# EAGLE board main (EAGLE 8.7.0)
TEXT: foo
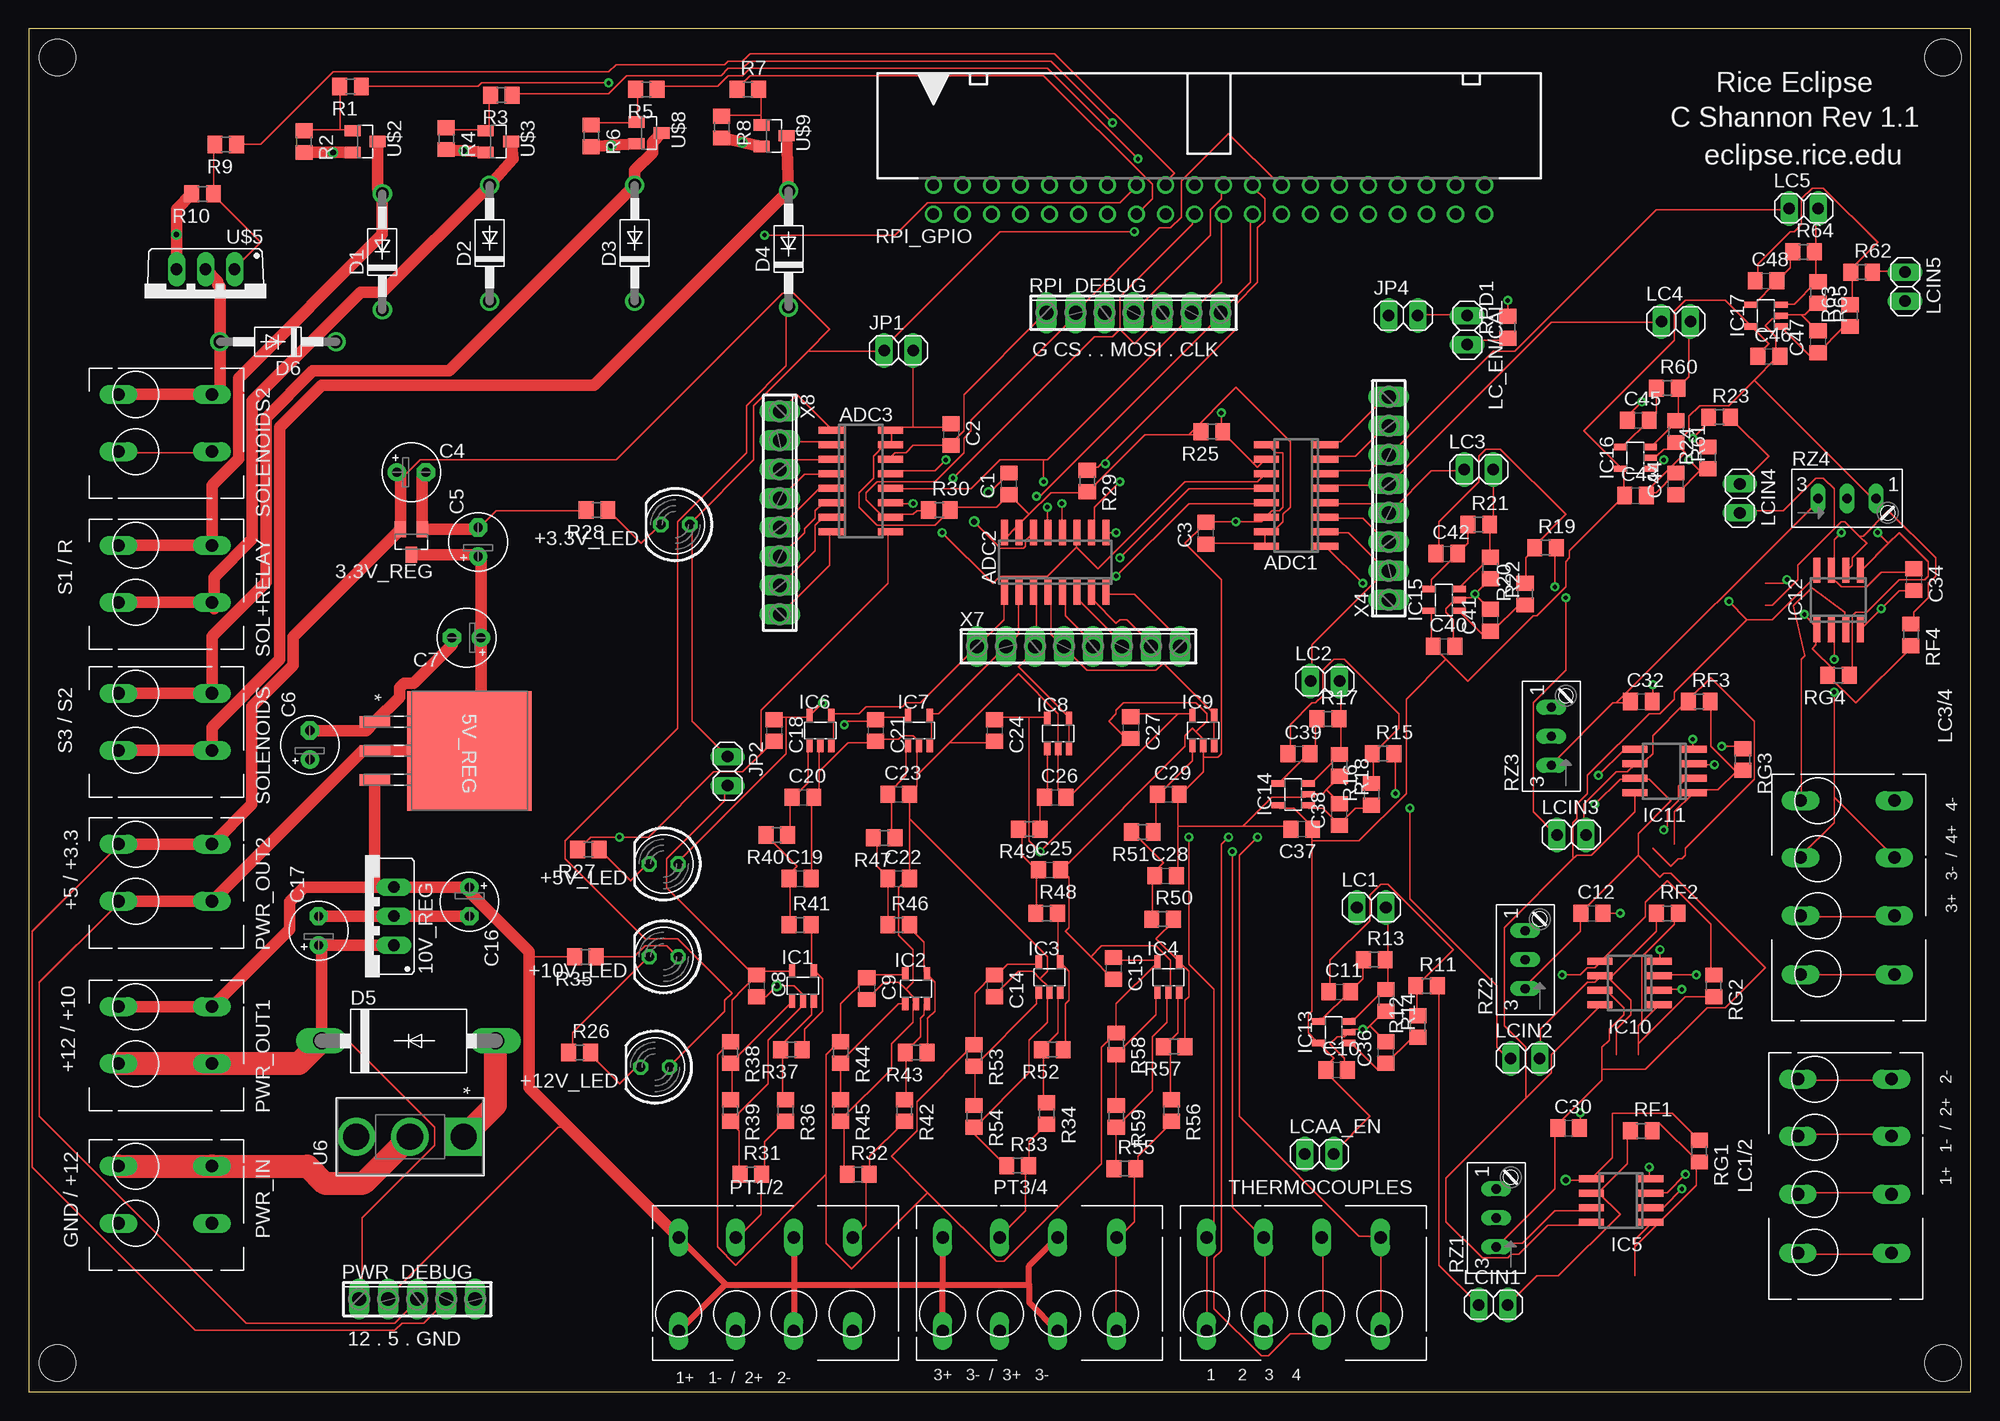
[diagram p10: board, top side]
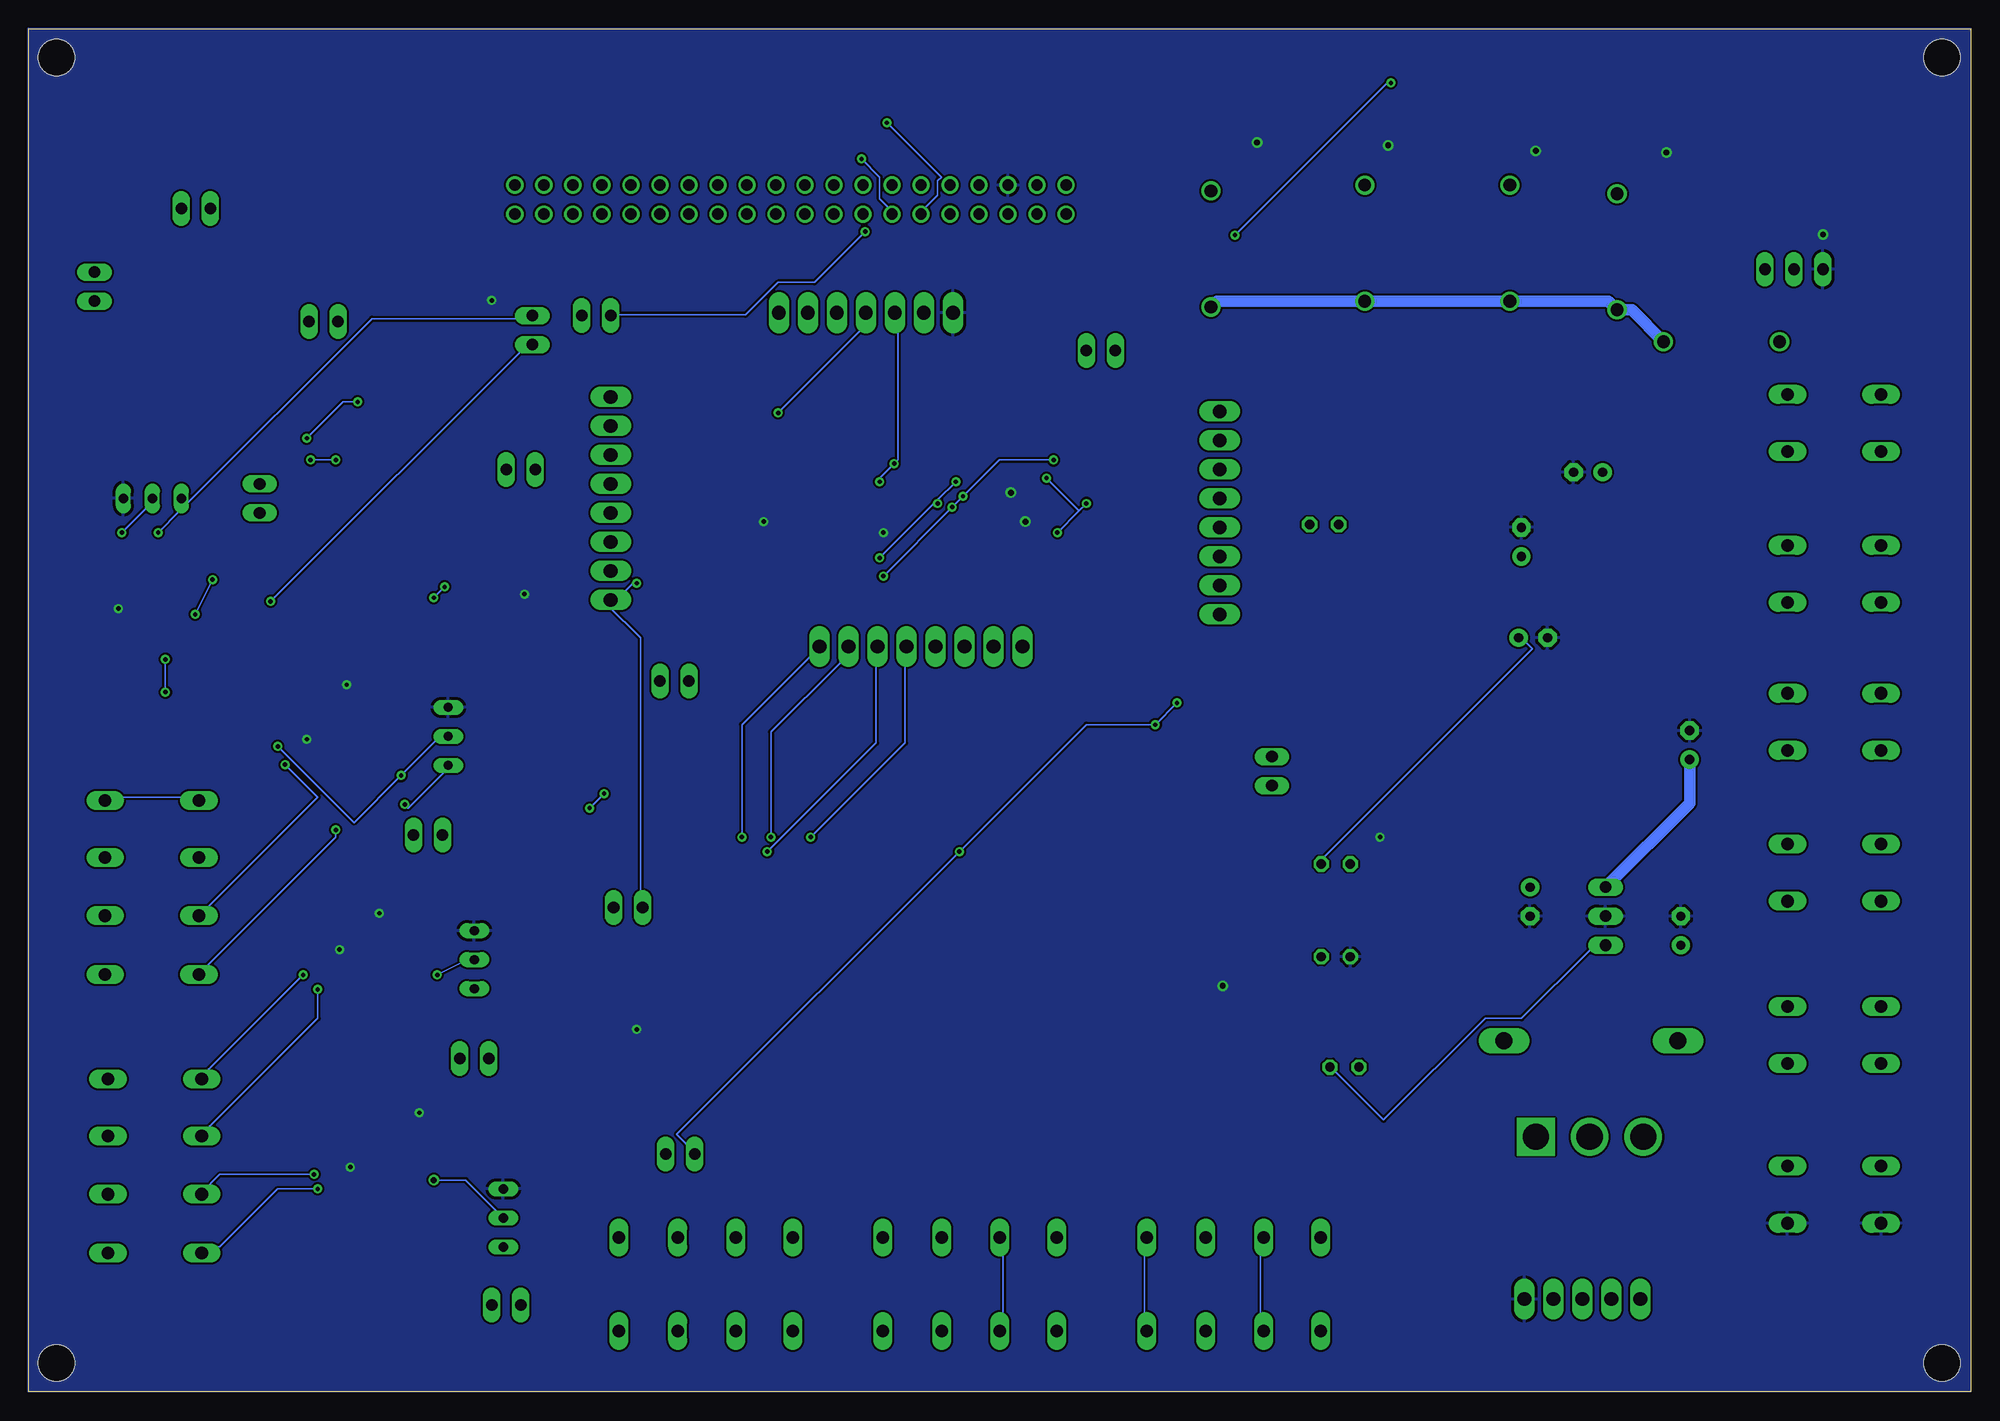
[diagram p11: board, bottom side, seen from below]

Size 170.1 x 119.37 mm. Coordinates in mm from the lower left corner, seen from the top.
Outline: 0,0 170.1,0 170.1,119.37 0,119.37 0,0
Copper layers (1*16): Top 0.0356mm / dielectric 63mil / Bottom 0.0356mm
Design rules "advanced": minimum track width 6mil, minimum drill 15mil, track to track 7mil, track to pad 7mil, pad to pad 7mil, via to via 7mil, smd to smd 7mil, copper to edge 0mil, drill to drill 6mil, minimum pad ring 10mil, minimum via ring 8mil, stop-mask expansion 4mil, vias tented up to drill 0mil, thermal gap 10mil
Holes 3.17 mm at 2.54,116.84 167.64,2.54 167.64,116.84 2.54,2.54

## Footprints (pad centres in the part's own frame; a part is rotated, then mirrored left to right if it is on the bottom)
SOT23 = smd 1 x 1.4: 1 -0.95,-1.1; 2 0.95,-1.1; 3 0,1.1
TS3B = smd 1.016 x 2.692: 1 -2.54,-8.28; 2 0,-8.28; 3 2.54,-8.28 | smd 10.465 x 10.871: 4 0,0
TO220S = drill 1.016 long: 1 -2.54,-2.54; 2 0,-2.54; 3 2.54,-2.54
LED5MM = drill 0.813 octagon: A -1.27,0; K 1.27,0
SO-16 = smd 0.6 x 2.2: 1 -4.445,-2.6; 2 -3.175,-2.6; 3 -1.905,-2.6; 4 -0.635,-2.6; 5 0.635,-2.6; 6 1.905,-2.6; 7 3.175,-2.6; 8 4.445,-2.6; 9 4.445,2.6; 10 3.175,2.6; 11 1.905,2.6; 12 0.635,2.6; 13 -0.635,2.6; 14 -1.905,2.6; 15 -3.175,2.6; 16 -4.445,2.6
C0805 = smd 1.3 x 1.5: 1 -0.95,0; 2 0.95,0
E2,5-5 = drill 0.813 pad 1.6: + -1.27,0 | drill 0.813 pad 1.6 octagon: - 1.27,0
DO41-10 = drill 1.118: A 5.08,0; C -5.08,0
DO201-15 = drill 1.499 long: A 7.62,0; C -7.62,0
SOT23-5 = smd 0.55 x 1.2: 1 -0.95,-1.3; 2 0,-1.3; 3 0.95,-1.3; 4 0.95,1.3; 5 -0.95,1.3
SO-8 = smd 0.6 x 2.2: 1 -1.905,-2.6; 2 -0.635,-2.6; 3 0.635,-2.6; 4 1.905,-2.6; 5 1.905,2.6; 6 0.635,2.6; 7 -0.635,2.6; 8 -1.905,2.6
1X02 = drill 1.016 long: 1 -1.27,0; 2 1.27,0
1991118 = drill 1.1 long: A1 -7.58,8.2; A2 -2.58,8.2; A3 2.5,8.2; A4 7.66,8.2; B1 -7.58,0; B2 -2.58,0; B3 2.5,0; B4 7.66,0
5POL254 = drill 1.2 long: 1 -5.08,0; 2 -2.54,0; 3 0,0; 4 2.54,0; 5 5.08,0
1991095 = drill 1.1 long: A1 -2.5,8.2; A2 2.5,8.2; B1 -2.5,0; B2 2.5,0
R0805 = smd 1.3 x 1.5: 1 -0.95,0; 2 0.95,0
7POL254 = drill 1.2 long: 1 -7.62,0; 2 -5.08,0; 3 -2.54,0; 4 0,0; 5 2.54,0; 6 5.08,0; 7 7.62,0
PAK100/2500-5-40 = drill 1 pad 1.422: 1 -24.13,-1.27; 2 -24.13,1.27; 3 -21.59,-1.27; 4 -21.59,1.27; 5 -19.05,-1.27; 6 -19.05,1.27; 7 -16.51,-1.27; 8 -16.51,1.27; 9 -13.97,-1.27; 10 -13.97,1.27; 11 -11.43,-1.27; 12 -11.43,1.27; 13 -8.89,-1.27; 14 -8.89,1.27; 15 -6.35,-1.27; 16 -6.35,1.27; 17 -3.81,-1.27; 18 -3.81,1.27; 19 -1.27,-1.27; 20 -1.27,1.27; 21 1.27,-1.27; 22 1.27,1.27; 23 3.81,-1.27; 24 3.81,1.27; 25 6.35,-1.27; 26 6.35,1.27; 27 8.89,-1.27; 28 8.89,1.27; 29 11.43,-1.27; 30 11.43,1.27; 31 13.97,-1.27; 32 13.97,1.27; 33 16.51,-1.27; 34 16.51,1.27; 35 19.05,-1.27; 36 19.05,1.27; 37 21.59,-1.27; 38 21.59,1.27; 39 24.13,-1.27; 40 24.13,1.27
S64W = drill 0.813 long: A 2.54,1.27; E -2.54,1.27; S 0,1.27
1101M2S3CQE2 = drill 2.286 pad 2.794 square: 1 0,9.398 | drill 2.286 pad 2.794: 2 0,4.699; 3 0,0
TO220BV = drill 1.016 long: D 0,-2.54; G -2.54,-2.54; S 2.54,-2.54
8POL254 = drill 1.2 long: 1 -8.89,0; 2 -6.35,0; 3 -3.81,0; 4 -1.27,0; 5 1.27,0; 6 3.81,0; 7 6.35,0; 8 8.89,0

## Placement (x,y rotation side)
3.3V_REG  AP2210N-3.3TRG1  [SOT23]  33.53,74.42 180 top
5V_REG  LM1084ISX-5.0/NOPB  [TS3B]  38.61,56.13 270 top
10V_REG  UA78M  [TO220S]  29.46,41.66 90 top
+3.3V_LED  [LED5MM]  56.64,75.95 180 top
+5V_LED  [LED5MM]  55.63,46.23 180 top
+10V_LED  [LED5MM]  55.63,38.1 180 top
+12V_LED  [LED5MM]  54.86,28.45 180 top
ADC1  MCP3208SN  [SO-16]  111,78.49 90 top
ADC2  MCP3208SN  [SO-16]  89.92,72.64 0 top
ADC3  MCP3208SN  [SO-16]  72.9,79.76 270 top
C1  1UF  [C0805]  85.85,79.5 90 top
C2  1UF  [C0805]  80.77,83.82 270 top
C3  1UF  [C0805]  103.12,75.18 90 top
C4  2.2UF  [E2,5-5]  33.53,80.52 0 top
C5  1UF  [E2,5-5]  39.37,74.42 90 top
C6  10UF  [E2,5-5]  24.64,56.64 90 top
C7  10UF  [E2,5-5]  38.35,66.04 180 top
C8  0.1UF  [C0805]  63.75,35.56 270 top
C9  0.1UF  [C0805]  73.41,35.31 270 top
C10  0.1UF  [C0805]  114.55,28.19 0 top
C11  1nF  [C0805]  114.81,35.05 0 top
C12  1UF  [C0805]  136.91,41.91 0 top
C14  0.1UF  [C0805]  84.58,35.56 270 top
C15  0.1UF  [C0805]  95,37.08 270 top
C16  0.1UF  [E2,5-5]  38.61,42.93 270 top
C17  0.33UF  [E2,5-5]  25.4,40.39 90 top
C18  0.1UF  [C0805]  65.28,57.91 270 top
C19  68nF  [C0805]  67.56,44.96 0 top
C20  680pF  [C0805]  67.82,52.07 0 top
C21  0.1UF  [C0805]  74.17,57.91 270 top
C22  68nF  [C0805]  76.2,44.96 0 top
C23  680pF  [C0805]  76.2,52.32 0 top
C24  0.1UF  [C0805]  84.58,57.91 270 top
C25  68nF  [C0805]  89.41,45.72 0 top
C26  680pF  [C0805]  89.92,52.07 0 top
C27  0.1UF  [C0805]  96.52,58.17 270 top
C28  68nF  [C0805]  99.57,45.21 0 top
C29  680pF  [C0805]  99.82,52.32 0 top
C30  1UF  [C0805]  134.87,23.11 0 top
C32  1UF  [C0805]  141.22,60.45 0 top
C34  1UF  [C0805]  165.1,71.12 270 top
C36  1nF  [C0805]  118.87,29.72 90 top
C37  0.1UF  [C0805]  111.51,49.28 180 top
C38  1nF  [C0805]  114.81,50.55 90 top
C39  1nF  [C0805]  111.25,55.88 0 top
C40  0.1UF  [C0805]  123.95,65.28 0 top
C41  1nF  [C0805]  128.02,67.56 90 top
C42  1nF  [C0805]  124.21,73.41 0 top
C43  0.1UF  [C0805]  140.72,78.49 0 top
C44  1nF  [C0805]  144.27,79.5 90 top
C45  1nF  [C0805]  140.97,85.09 0 top
C46  0.1UF  [C0805]  152.4,90.68 0 top
C47  ?  [C0805]  156.72,91.95 90 top
C48  ?  [C0805]  152.15,97.28 0 top
D1  1N4004  [DO41-10]  30.99,99.82 90 top
D2  1N4004  [DO41-10]  40.39,100.58 90 top
D3  1N4004  [DO41-10]  53.09,100.58 90 top
D4  1N4004  [DO41-10]  66.55,100.08 90 top
D5  [DO201-15]  33.27,30.73 0 top
D6  1N4004  [DO41-10]  21.84,91.95 180 top
IC1  LMV321LICTRT  [SOT23-5]  67.82,35.56 0 top
IC2  LMV321LICTRT  [SOT23-5]  77.72,35.31 0 top
IC3  LMV321LICTRT  [SOT23-5]  89.41,36.32 0 top
IC4  LMV321LICTRT  [SOT23-5]  99.82,36.32 0 top
IC5  MCP6N11R  [SO-8]  139.45,16.76 90 top
IC6  LMV321LICTRT  [SOT23-5]  69.34,57.91 0 top
IC7  LMV321LICTRT  [SOT23-5]  77.98,57.91 0 top
IC8  LMV321LICTRT  [SOT23-5]  90.17,57.66 0 top
IC9  LMV321LICTRT  [SOT23-5]  102.87,57.91 0 top
IC10  MCP6N11R  [SO-8]  140.21,35.81 90 top
IC11  MCP6N11R  [SO-8]  143.26,54.36 90 top
IC12  MCP6N11R  [SO-8]  158.5,69.34 0 top
IC13  LMV321LICTRT  [SOT23-5]  114.3,31.5 90 top
IC14  LMV321LICTRT  [SOT23-5]  110.74,52.32 90 top
IC15  LMV321LICTRT  [SOT23-5]  123.95,69.34 90 top
IC16  LMV321LICTRT  [SOT23-5]  140.72,81.79 90 top
IC17  LMV321LICTRT  [SOT23-5]  152.15,94.23 90 top
JP1  [1X02]  76.2,91.19 0 top
JP2  [1X02]  61.21,54.36 270 top
JP4  [1X02]  120.4,94.23 0 top
LC1  [1X02]  117.6,42.42 0 top
LC1/2  1991118  [1991118]  154.94,19.81 270 top
LC2  [1X02]  113.54,62.23 0 top
LC3  [1X02]  127,80.77 0 top
LC3/4  1991118  [1991118]  155.19,44.2 270 top
LC4  [1X02]  144.27,93.73 0 top
LC5  [1X02]  155.45,103.63 0 top
LC_EN/CAL  [1X02]  125.98,92.96 270 top
LCAA_EN  [1X02]  113.03,20.83 0 top
LCIN1  [1X02]  128.27,7.62 0 top
LCIN2  [1X02]  131.06,29.21 0 top
LCIN3  [1X02]  135.13,48.77 0 top
LCIN4  [1X02]  149.86,78.23 270 top
LCIN5  [1X02]  164.34,96.77 270 top
PT1/2  1991118  [1991118]  64.52,5.33 0 top
PT3/4  1991118  [1991118]  87.63,5.33 0 top
PWR_DEBUG  [5POL254]  34.04,8.13 0 top
PWR_IN  1991095  [1991095]  7.87,17.27 270 top
PWR_OUT1  1991095  [1991095]  7.87,31.24 270 top
PWR_OUT2  1991095  [1991095]  7.87,45.47 270 top
R1  10k  [R0805]  28.19,114.3 180 top
R2  500k  [R0805]  24.13,109.47 270 top
R3  10k  [R0805]  41.4,113.54 180 top
R4  500k  [R0805]  36.58,109.73 270 top
R5  10k  [R0805]  54.1,114.05 180 top
R6  500k  [R0805]  49.28,109.98 270 top
R7  10k  [R0805]  62.99,114.05 0 top
R8  500k  [R0805]  60.71,110.74 270 top
R9  10k  [R0805]  17.27,109.22 180 top
R10  500k  [R0805]  15.24,104.9 180 top
R11  24.7K  [R0805]  122.43,35.56 0 top
R12  164K  [R0805]  121.67,32 90 top
R13  50.6K  [R0805]  117.86,37.85 0 top
R14  12.6K  [R0805]  118.87,34.29 270 top
R15  24.7K  [R0805]  118.62,55.88 0 top
R16  164K  [R0805]  117.6,52.32 90 top
R17  50.6K  [R0805]  113.79,58.93 0 top
R18  12.6K  [R0805]  114.81,54.86 270 top
R19  24.7K  [R0805]  132.84,73.91 0 top
R20  164K  [R0805]  131.06,69.85 90 top
R21  50.6K  [R0805]  127,75.95 0 top
R22  12.6K  [R0805]  128.02,72.14 270 top
R23  24.7K  [R0805]  148.08,85.34 0 top
R24  164K  [R0805]  147.07,81.79 90 top
R25  500K  [R0805]  103.63,84.07 180 top
R26  530  [R0805]  48.26,29.72 0 top
R27  140  [R0805]  49.02,47.5 180 top
R28  39  [R0805]  49.78,77.22 180 top
R29  500K  [R0805]  92.71,79.76 270 top
R30  500K  [R0805]  79.76,77.22 0 top
R31  22  [R0805]  63.25,19.05 0 top
R32  22  [R0805]  72.64,19.05 0 top
R33  22  [R0805]  86.61,19.81 0 top
R34  20K  [R0805]  89.15,24.38 270 top
R35  470  [R0805]  48.77,38.1 180 top
R36  20K  [R0805]  66.29,24.64 270 top
R37  150K  [R0805]  66.8,29.97 180 top
R38  20K  [R0805]  61.47,29.72 270 top
R39  3K  [R0805]  61.47,24.64 270 top
R40  150K  [R0805]  65.53,48.77 180 top
R41  1.5K  [R0805]  67.56,40.89 0 top
R42  20K  [R0805]  76.71,24.64 270 top
R43  150K  [R0805]  77.72,29.72 180 top
R44  20K  [R0805]  71.12,29.72 270 top
R45  3K  [R0805]  71.12,24.64 270 top
R46  1.5K  [R0805]  76.2,40.89 0 top
R47  150K  [R0805]  74.93,48.51 180 top
R48  1.5K  [R0805]  89.15,41.91 0 top
R49  150K  [R0805]  87.63,49.28 180 top
R50  1.5K  [R0805]  99.31,41.4 0 top
R51  150K  [R0805]  97.54,49.02 180 top
R52  150K  [R0805]  89.66,29.97 180 top
R53  20K  [R0805]  82.8,29.46 270 top
R54  3K  [R0805]  82.8,24.13 270 top
R55  22  [R0805]  96.01,19.56 0 top
R56  20K  [R0805]  100.08,24.64 270 top
R57  150K  [R0805]  100.33,30.23 180 top
R58  20K  [R0805]  95.25,30.48 270 top
R59  3K  [R0805]  95.25,24.13 270 top
R60  50.6K  [R0805]  143.51,87.88 0 top
R61  12.6K  [R0805]  144.27,84.07 270 top
R62  ?  [R0805]  160.53,98.04 0 top
R63  ?  [R0805]  159.51,94.23 90 top
R64  ?  [R0805]  155.45,99.82 0 top
R65  ?  [R0805]  156.72,96.27 270 top
RF1  20K  [R0805]  141.22,22.86 0 top
RF2  20K  [R0805]  143.51,41.91 0 top
RF3  20K  [R0805]  146.3,60.45 0 top
RF4  20K  [R0805]  164.85,66.29 270 top
RG1  200  [R0805]  146.3,21.08 270 top
RG2  200  [R0805]  147.57,35.56 270 top
RG3  200  [R0805]  150.11,55.37 270 top
RG4  200  [R0805]  158.5,62.74 180 top
RPD1  20K  [R0805]  129.54,93.22 90 top
RPI_DEBUG  [7POL254]  96.77,94.49 0 top
RPI_GPIO  2540-5  [PAK100/2500-5-40]  103.38,104.39 0 top
RZ1  [S64W]  129.79,15.24 90 top
RZ2  [S64W]  132.33,37.85 90 top
RZ3  [S64W]  134.62,57.4 90 top
RZ4  [S64W]  159.26,76.96 0 top
SOL+RELAY  1991095  [1991095]  7.87,71.63 270 top
SOLENOIDS  1991095  [1991095]  7.87,58.67 270 top
SOLENOIDS2  1991095  [1991095]  7.87,84.84 270 top
THERMOCOUPLES  1991118  [1991118]  110.74,5.33 0 top
U6  1101M2S3CQE2  [1101M2S3CQE2]  28.7,22.35 270 top
U$2  2N7000  [SOT23]  29.46,109.47 270 top
U$3  2N7000  [SOT23]  41.15,109.47 270 top
U$5  IRF740  [TO220BV]  15.49,95.76 180 top
U$8  2N7000  [SOT23]  54.36,110.24 270 top
U$9  2N7000  [SOT23]  65.28,109.98 270 top
X4  [8POL254]  119.13,78.23 90 top
X7  [8POL254]  91.95,65.28 0 top
X8  [8POL254]  65.79,76.96 270 top

## Tracks (layer width: path | path; a pad name or v marks a point on that pad's centre or on a via)
+3V3  (via drill 0.38)
  Top 0.152: PWR_DEBUG.4 36.51,7.94 34.61,6.03 32.7,6.03 32.07,5.4 14.61,5.4 0.32,19.68 0.32,40.32 7.62,47.62 PWR_OUT2.B1 | JP2.1 58.1,58.74 58.1,75.88 +3.3V_LED.A 58.1,76.2 63.5,81.6 63.5,86.36 68.26,91.12 | 68.26,91.12 74.93,91.12 JP1.1 74.93,91.44 85.09,101.6 v96.84,101.6 | 68.26,91.12 70.17,93.03 66.99,96.2 66.04,96.2 51.44,81.6 34.29,81.6 33.02,80.33 C4.+
  Top 1.016: PWR_OUT2.B1 PWR_OUT2.A1 19.56,51.45 19.56,60.01 23.18,63.63 23.18,66.13 3.3V_REG.2 32.58,80.2 C4.+
  Bottom 0.152: v96.84,101.6 101.28,97.16 104.46,97.16 107.31,94.3 119.06,94.3 JP4.1
+3V3_ADC
  Top 0.152: 77.47,84.45 75.56,84.45 ADC3.16 75.56,84.14 75.56,83.19 ADC3.15 75.25,82.87 74.93,82.87 73.98,81.92 73.98,80.01 72.71,78.74 72.71,77.47 74.3,75.88 79.38,75.88 80.64,77.15 R30.2 80.96,77.47 84.77,77.47 85.72,78.42 C1.1 86.04,78.42 87.63,76.83 | 77.47,84.45 80.64,84.45 C2.1 | 77.47,84.45 JP1.2 | 108.27,74.3 103.19,74.3 C3.1 | 108.27,74.3 108.27,75.25 ADC1.15 108.58,75.56 109.22,75.56 109.86,76.2 109.86,76.83 110.49,77.47 110.49,83.19 105.73,87.95 101.6,83.82 | 108.27,74.3 ADC1.16 | 92.71,78.74 89.53,78.74 87.63,76.83 | 86.36,75.56 85.72,74.93 ADC2.16 | 86.36,75.56 87.63,76.83 | 101.6,83.82 97.79,83.82 92.71,78.74 | 101.6,83.82 102.55,83.82 R25.2 | 92.71,78.74 R29.2 | 86.36,75.56 86.68,75.25 ADC2.15
+3V3_LC  (via drill 0.38)
  Top 0.152: 135.89,41.91 135.89,40.32 131.13,35.56 RZ2.E | 140.97,46.99 140.97,48.9 143.83,51.75 141.92,53.66 140.97,53.66 IC11.7 140.65,53.66 139.38,53.66 v137.16,51.44 | 135.89,41.91 140.97,46.99 | 135.89,41.91 C12.1 | 128.91,13.02 128.59,12.7 RZ1.E 128.91,13.02 | 128.91,13.02 133.67,17.78 133.67,22.86 C30.1 133.67,23.18 137.79,27.3 137.79,28.26 | 128.91,13.02 130.81,13.02 133.67,15.88 136.84,15.88 IC5.7 | 137.79,28.26 137.79,30.16 138.43,30.8 138.43,31.75 139.7,33.02 139.7,33.66 138.43,34.92 137.79,34.92 IC10.7 | 140.97,46.99 142.88,45.09 143.19,45.4 143.83,45.4 152.08,37.15 148.59,33.66 147,33.66 141.6,28.26 137.79,28.26 | JP4.2 121.92,94.3 125.73,94.3 LC_EN/CAL.1 | C34.1 165.1,71.75 162.24,71.75 160.97,70.48 158.75,70.48 157.8,71.44 158.12,71.75 IC12.7 158.12,72.07 158.12,74.61 v158.75,75.25 | 139.06,60.33 138.75,60.33 133.35,54.93 RZ3.E | 139.06,60.33 140.02,60.33 C32.1 | 139.06,60.33 156.53,77.79 156.53,78.11 RZ4.E
  Bottom 0.152: 156.84,77.15 v158.75,75.25 | 156.84,77.15 156.84,78.11 RZ4.E 156.84,77.15 | 156.84,77.15 140.02,93.98 126.05,93.98 LC_EN/CAL.1 | v137.16,51.44 136.84,51.12 133.35,54.61 RZ3.E
+3V3_PT
  Top 0.152: IC1.5 66.67,36.83 64.14,36.83 63.82,36.51 C8.1 | C8.1 63.5,36.2 62.67,35.37 61.59,34.29 61.59,30.8 R38.1 61.28,30.48 60.33,29.53 60.33,12.7 61.91,11.11 69.85,19.05 | JP2.2 60.96,53.02 60.96,51.75 55.88,46.67 55.88,44.13 63.5,36.51 C8.1 | IC2.5 76.52,36.51 73.66,36.51 C9.1 73.34,36.2 71.12,33.97 R44.1 71.12,30.48 70.8,30.48 69.85,29.53 69.85,19.05 | C15.1 95.25,37.78 98.74,37.78 IC4.5 98.74,37.47 95.25,33.97 R58.1 95.25,31.11 94.93,31.11 93.98,30.16 93.98,20 85.41,11.43 84.77,11.43 78.74,17.46 | IC3.5 88.27,37.47 85.72,37.47 84.77,36.51 C14.1 84.45,36.51 82.87,34.92 82.87,30.48 R53.1 82.55,30.16 77.79,25.4 77.79,22.86 75.56,20.64 78.74,17.46 | 69.85,19.05 69.85,13.02 72.07,10.79 78.74,17.46
+5V  (via drill 0.38)
  Top 0.152: PWR_DEBUG.3 33.97,7.94 32.07,6.03 19.05,6.03 0.95,24.13 0.95,35.88 7.62,42.55 PWR_OUT2.B2 | IC7.5 76.83,59.05 74.3,59.05 C21.1 73.98,58.74 71.75,58.74 v71.44,58.42 | 66.36,59.05 65.41,59.05 C18.1 | 66.36,59.05 68.26,59.05 IC6.5 68.58,59.37 v69.53,60.33 | 66.36,59.05 66.36,55.88 57.15,46.67 57.15,46.35 +5V_LED.A | 87.63,59.05 84.77,59.05 C24.1 | 87.63,59.05 89.22,59.05 IC8.5 | 100.65,59.37 96.52,59.37 C27.1 | 100.65,59.37 101.92,59.37 IC9.5 | 87.63,59.05 87.63,48.26 v88.58,47.31 100.65,59.37
  Top 1.016: PWR_OUT2.B2 PWR_OUT2.A2 29.24,56.13 5V_REG.2 36.07,56.13 36.32,55.88 | 36.32,55.88 38.35,55.88 | 38.35,55.88 5V_REG.4 | 36.32,55.88 33.53,55.88 | 3.3V_REG.3 39.2,73.32 C5.+ 39.62,72.9 C7.+ 39.62,59.69 | 39.37,58.67 39.62,58.93 39.62,59.69 | 39.62,59.69 39.37,59.94 38.35,58.93 38.35,55.88
  Bottom 0.152: v69.53,60.33 v71.44,58.42 77.47,58.42 v88.58,47.31 113.35,22.54 111.76,20.95 LCAA_EN.1 | C7.+ 39.37,66.04 38.42,65.09 57.15,46.35 +5V_LED.A
+5V_LCAA
  Top 0.152: IC14.5 109.54,51.12 110.81,51.12 112.39,49.53 C37.1 112.39,49.21 112.39,48.26 | LCAA_EN.2 114.3,20.95 117.47,24.13 113.67,27.94 C10.1 113.35,28.26 114.3,29.21 113.03,30.48 IC13.5 112.71,30.8 112.08,31.43 112.08,33.02 112.39,33.34 112.39,48.26 | IC15.5 122.87,68.26 122.87,65.41 C40.1 123.19,65.09 124.14,64.14 | C46.1 151.45,90.81 152.4,91.76 151.13,93.03 IC17.5 150.81,93.34 148.59,95.57 145.1,95.57 144.15,94.61 144.15,92.08 136.21,84.14 139.38,80.96 IC16.5 139.7,80.64 139.7,78.74 C43.1 139.7,78.42 134.94,73.66 134.94,73.03 134.62,72.71 134.62,70.48 132.08,67.94 131.76,67.94 126.05,62.23 124.14,64.14 | 112.39,48.26 116.52,48.26 120.65,52.39 120.65,60.64 124.14,64.14
+10V
  Top 0.152: 43.83,38.1 R35.2 | 46.98,23.49 46.67,23.18 46.35,23.18 31.43,8.26 PWR_DEBUG.2
  Top 0.508: PT1/2.A1 61.07,9.4 | 61.07,9.4 67.06,9.4 | 67.06,9.4 80.01,9.4 | 80.01,9.4 87.63,9.4 | 87.63,9.4 87.63,11.03 PT3/4.A3 | 87.63,9.4 87.63,7.83 PT3/4.B3 | PT3/4.A1 80.05,9.44 80.01,9.4 | 80.01,9.4 80.01,5.37 PT3/4.B1 | 61.07,9.4 61,9.4 PT1/2.B1 | PT1/2.A3 67.06,13.49 67.06,9.4 | 67.06,9.4 67.06,4.83 67.02,4.79 | 66.8,4.57 67.02,4.79 | 67.02,4.79 PT1/2.B3
  Top 1.016: PWR_OUT1.B1 PWR_OUT1.A1 22.86,40.53 22.86,42.93 24.13,44.2 30.23,44.2 | 30.23,44.2 10V_REG.3 C16.+ 38.61,43.76 43.83,38.54 43.83,38.1 43.83,26.64 46.98,23.49 PT1/2.A1 | 5V_REG.3 30.33,44.3 30.23,44.2
  Bottom 1.016: C6.+ 24.64,51.56 10V_REG.3
+12V
  Top 0.152: PWR_DEBUG.1 29.21,8.26 29.21,15.24 35.56,21.59 35.56,23.18 26.99,31.75 26.35,31.11 D5.C | D4.C 66.36,94.93 66.36,89.85 62.87,86.36 62.87,82.23 56.83,76.2 56.83,58.1 46.99,48.26 46.99,46.67 53.98,39.69 56.83,39.69 61.59,34.92 60.96,34.29 60.96,33.34 56.2,28.57 +12V_LED.A
  Top 1.016: D5.C 25.65,38.86 C17.+ 10V_REG.1
  Top 2.032: D5.C 23.66,28.74 PWR_OUT1.A2 PWR_OUT1.B2
  Bottom 0.152: 10V_REG.1 32.38,38.73 33.34,38.73 39.37,32.7 42.55,32.7 51.44,23.81 55.88,28.26 +12V_LED.A
  Bottom 1.016: D6.C 29.72,94.74 D1.C 31.75,95.5 D2.C D3.C 66.04,95.5 D4.C
+12V_DEBUG
  Top 2.032: PWR_IN.B1 PWR_IN.A1 24.42,19.77 25.91,18.29 29.34,18.29 U6.2
ADC1_A0  (via drill 0.38)
  Top 0.152: v116.84,70.8 113.67,73.98 ADC1.1
  Bottom 0.152: v116.84,70.8 117.16,70.8 118.11,69.85 118.75,69.85 119.06,69.53 X4.1 119.06,69.22 119.38,68.9 116.52,66.04 116.52,42.55 LC1.1
ADC1_A1
  Top 0.152: ADC1.2 113.67,75.25 115.57,75.25 119.06,71.75 X4.2 119.06,72.07 112.39,65.41 112.39,62.23 LC2.1
ADC1_A2
  Top 0.152: ADC1.3 113.67,76.52 116.84,76.52 119.06,74.3 X4.3
ADC1_A3
  Top 0.152: ADC1.4 113.67,77.79 118.43,77.79 119.06,77.15 X4.4 119.38,77.15 122.87,80.64 125.73,80.64 LC3.1
ADC1_A4
  Top 0.152: ADC1.5 113.67,79.38 119.06,79.38 X4.5 119.38,79.69 133.35,93.66 142.88,93.66 LC4.1
ADC1_A5
  Top 0.152: ADC1.6 113.67,80.64 117.47,80.64 119.06,82.23 X4.6 119.38,82.23 128.27,91.12 130.18,91.12 142.56,103.5 153.99,103.5 LC5.1
ADC1_A6
  Top 0.152: ADC1.7 113.67,81.92 116.2,81.92 119.06,84.77 X4.7
ADC1_A7
  Top 0.152: ADC1.8 113.67,83.19 114.94,83.19 119.06,87.31 X4.8
ADC1_CS  (via drill 0.38)
  Top 0.152: ADC1.10 108.27,81.6 107.63,80.96 104.78,83.82 R25.1 104.46,84.14 v104.46,85.72 | RPI_GPIO.22 104.46,105.41 104.46,104.46 103.5,103.5 103.5,101.28 96.84,94.61 RPI_DEBUG.4
  Bottom 0.152: v104.46,85.72 97.16,93.03 97.16,93.98 96.84,94.3 RPI_DEBUG.4
ADC2_A0
  Top 0.152: IC6.3 70.48,56.83 70.48,59.05 IC6.4 70.48,59.37 72.71,59.37 73.34,60.01 76.52,60.01 76.83,60.33 78.11,60.33 X7.1 85.41,67.63 85.41,69.85 ADC2.1
ADC2_A1
  Top 0.152: IC7.3 79.06,56.83 79.06,59.05 IC7.4 79.06,59.37 79.69,59.37 X7.2 86.68,66.36 86.68,69.85 ADC2.2
ADC2_A2
  Top 0.152: IC8.3 91.12,56.52 91.12,58.74 IC8.4 91.12,59.05 86.68,63.5 88.27,65.09 X7.3 88.27,65.41 88.27,69.85 ADC2.3
ADC2_A3
  Top 0.152: IC9.3 103.82,56.83 103.82,59.05 IC9.4 103.82,59.37 99.38,63.82 98.74,63.18 92.71,63.18 90.81,65.09 X7.4 90.49,65.41 89.53,66.36 89.53,69.85 ADC2.4
ADC2_A4  (via drill 0.38)
  Top 0.152: ADC2.5 90.81,69.85 90.81,67.94 93.34,65.41 X7.5 | THERMOCOUPLES.B1 103.19,5.4 103.19,13.34 THERMOCOUPLES.A1 103.19,13.65 103.82,14.29 103.82,35.24 101.6,37.47 v101.6,48.58
  Bottom 0.152: v101.6,48.58 93.34,56.83 93.34,65.09 X7.5
ADC2_A5  (via drill 0.38)
  Top 0.152: ADC2.6 92.08,69.85 92.08,69.22 95.89,65.41 X7.6 | THERMOCOUPLES.B2 108.27,5.4 108.27,13.34 THERMOCOUPLES.A2 107.95,13.65 105.41,16.19 v105.41,47.31
  Bottom 0.152: v105.41,47.31 95.89,56.83 95.89,65.09 X7.6
ADC2_A6  (via drill 0.38)
  Top 0.152: THERMOCOUPLES.A3 113.35,13.34 113.35,5.4 THERMOCOUPLES.B3 113.03,5.08 110.49,5.08 108.58,3.17 107.95,3.17 103.82,7.3 103.82,11.75 104.46,12.38 104.46,47.94 v105.09,48.58 | ADC2.7 93.34,69.85 93.34,69.22 95.25,67.31 95.57,67.63 96.2,67.63 98.42,65.41 X7.7
  Bottom 0.152: v105.09,48.58 105.09,57.78 99.06,63.82 99.06,64.45 98.42,65.09 X7.7
ADC2_A7  (via drill 0.38)
  Top 0.152: THERMOCOUPLES.B4 118.43,5.4 118.43,13.34 THERMOCOUPLES.A4 118.11,13.65 116.52,13.65 106.05,24.13 106.05,46.99 v107.63,48.58 | ADC2.8 94.61,69.85 96.84,69.85 100.97,65.72 100.65,65.41 X7.8
  Bottom 0.152: v107.63,48.58 107.63,58.42 100.97,65.09 X7.8
ADC2_CS  (via drill 0.38)
  Top 0.152: 93.98,81.28 105.73,93.03 105.73,95.25 107.63,97.16 107.63,101.92 108.27,102.55 108.27,104.46 107.31,105.41 RPI_GPIO.24 | 93.98,81.28 93.66,80.96 92.71,80.96 R29.1 | v95.57,79.69 93.34,77.47 93.34,75.25 ADC2.10 | 93.98,81.28 v94.3,81.28
  Bottom 0.152: v95.57,79.69 95.57,80.01 v94.3,81.28 93.98,81.6 93.98,94.3 RPI_DEBUG.3
ADC3_A0
  Top 0.152: ADC3.1 70.17,84.45 67.31,87.31 66.04,86.04 X8.1
ADC3_A1
  Top 0.152: ADC3.2 70.17,83.19 66.04,83.19 X8.2
ADC3_A2
  Top 0.152: ADC3.3 70.17,81.6 66.67,81.6 66.04,80.96 X8.3
ADC3_A3
  Top 0.152: ADC3.4 70.17,80.33 67.94,80.33 66.04,78.42 X8.4
ADC3_A4
  Top 0.152: ADC3.5 70.17,79.06 69.22,79.06 66.04,75.88 X8.5
ADC3_A5
  Top 0.152: ADC3.6 70.17,77.79 69.53,77.79 68.9,77.15 68.9,76.52 67.94,75.56 67.94,75.25 66.04,73.34 X8.6
ADC3_A6
  Top 0.152: ADC3.7 70.17,76.52 69.53,76.52 68.9,75.88 68.9,73.66 66.04,70.8 X8.7
ADC3_A7
  Top 0.152: ADC3.8 70.17,75.25 70.17,72.39 66.04,68.26 X8.8
ADC3_CS
  Top 0.152: R30.1 78.74,77.15 77.79,77.15 77.47,76.83 75.56,76.83 ADC3.10 75.25,76.83 74.61,76.83 73.34,78.11 73.34,78.74 74.3,79.69 79.38,79.69 81.92,82.23 81.92,83.5 82.55,84.14 82.55,85.09 91.76,94.3 RPI_DEBUG.2 91.76,94.61 99.06,101.92 100.01,101.92 100.97,102.87 100.97,106.05 105.09,110.17 109.54,105.73 RPI_GPIO.26
CAL  (via drill 0.38)
  Top 0.152: LC_EN/CAL.2 126.36,92.08 129.54,92.08 RPD1.1 | 131.13,25.72 133.35,27.94 133.35,29.53 137.48,33.66 IC10.8 | 131.13,25.72 124.14,18.73 124.14,14.92 127.32,11.75 129.54,11.75 129.86,12.06 130.49,12.06 133.03,14.61 136.84,14.61 IC5.8 | 135.25,46.67 129.22,40.64 129.22,32.07 131.13,30.16 131.13,25.72 | 135.25,46.67 135.57,46.99 136.84,46.99 140.65,50.8 140.65,52.39 IC11.8 | 150.5,67.63 152.72,67.63 156.53,71.44 156.53,71.75 IC12.8 | 150.5,67.63 144.15,61.28 144.15,60.64 142.88,59.37 141.92,59.37 136.53,53.98 136.53,52.39 135.57,51.44 135.57,50.16 135.25,49.85 135.25,46.67 | 150.5,67.63 v148.91,69.22
  Bottom 0.152: v148.91,69.22 126.68,91.44 126.05,91.44 LC_EN/CAL.2
CTRL_SOLENOID_1  (via drill 0.38)
  Top 0.152: v94.93,111.12 89.53,116.52 63.18,116.52 62.55,115.89 61.28,115.89 60.64,115.25 52.39,115.25 50.8,113.67 42.55,113.67 R3.1
  Bottom 0.152: v94.93,111.12 90.17,106.36 90.49,106.05 90.49,104.78 92.08,103.19 RPI_GPIO.11
CTRL_SOLENOID_2  (via drill 0.38)
  Top 0.152: v97.16,107.95 89.22,115.89 63.18,115.89 62.55,115.25 61.28,115.25 60.33,114.3 55.24,114.3 R5.1
  Bottom 0.152: v97.16,107.95 95.57,106.36 95.57,104.46 94.3,103.19 RPI_GPIO.13
CTRL_SOLENOID_3
  Top 0.152: R7.1 62.23,114.3 63.18,115.25 88.9,115.25 98.42,105.73 98.42,104.46 97.16,103.19 RPI_GPIO.15
CTRL_SOLENOID_4
  Top 0.152: R9.1 20.32,109.22 26.67,115.57 50.8,115.57 51.44,116.2 60.96,116.2 61.28,116.52 62.55,116.52 63.18,117.16 89.85,117.16 100.33,106.68 99.38,105.73 RPI_GPIO.18
GND  (via drill 0.38, 0.51)
  Top 0.152: 88.58,36.2 87.95,36.83 86.68,36.83 84.77,34.92 C14.2 | 88.58,36.2 89.22,35.56 89.22,35.24 IC3.2 89.22,34.92 89.22,32.38 87.63,30.8 87.63,27.94 82.87,23.18 | 82.87,23.18 82.55,22.86 85.41,20 R33.1 | 82.87,23.18 R54.2 | 76.83,35.24 76.2,35.88 74.93,35.88 73.66,34.61 C9.2 | 76.83,35.24 77.47,34.61 77.47,34.29 IC2.2 77.47,33.97 77.47,32.38 75.56,30.48 75.56,28.26 71.12,23.81 R45.2 71.12,23.5 71.44,23.18 71.44,19.05 R32.1 | 69.22,54.29 69.22,52.39 68.9,52.07 C20.2 68.58,52.07 68.58,45.09 C19.2 | 69.22,54.29 69.22,56.52 IC6.2 | 69.22,54.29 71.75,56.83 73.98,56.83 C21.2 74.3,57.15 76.2,57.15 76.52,57.47 77.47,57.47 78.11,56.83 IC7.2 77.79,56.52 77.79,53.98 | 96.2,57.15 96.52,57.15 C27.2 96.2,57.15 | 96.2,57.15 91.12,52.07 C26.2 90.81,52.07 90.17,52.7 IC8.2 90.17,59.37 86.68,62.87 80.64,56.83 | 77.79,53.98 77.79,53.02 77.15,52.39 C23.2 77.15,52.07 77.15,50.16 | 77.15,50.16 77.15,45.09 C22.2 76.83,44.77 76.2,44.13 76.2,40.01 77.47,38.73 77.47,35.88 76.83,35.24 | 80.64,56.83 84.45,56.83 C24.2 | 77.79,53.98 80.64,56.83 | 88.58,36.2 89.22,36.83 89.22,38.1 77.15,50.16 | 113.67,52.7 114.62,53.66 R18.2 | 113.67,52.7 113.35,52.39 112.08,52.39 IC14.2 111.76,52.07 108.9,52.07 106.36,49.53 | 113.67,52.7 114.62,51.75 C38.2 | 102.87,55.56 102.87,54.29 100.97,52.39 C29.2 100.65,52.07 100.65,49.53 | 102.87,55.56 IC9.2 102.87,57.15 102.23,57.78 | 100.65,49.53 100.65,45.4 C28.2 | 100.65,49.53 106.36,49.53 | 106.36,49.53 110.49,49.53 C37.2 | 93.03,38.1 90.81,40.32 91.12,40.64 91.12,45.09 90.49,45.72 | 93.03,38.1 94.93,36.2 C15.2 | R59.2 98.42,26.35 98.42,31.11 99.69,32.38 99.69,34.92 IC4.2 100.01,35.24 100.01,37.78 98.74,39.05 93.98,39.05 93.03,38.1
  Top 0.152: R59.2 95.25,19.68 R55.1 | R59.2 | 102.23,57.78 101.92,58.1 101.28,57.47 101.28,56.52 90.49,45.72 | 90.49,45.72 C25.2 | 64.14,55.88 65.09,56.83 C18.2 | 64.14,55.88 62.55,54.29 60.01,54.29 54.29,48.58 v51.75,48.58 49.21,48.58 48.26,47.62 R27.2 | 64.14,55.88 64.14,59.69 75.25,70.8 75.25,75.25 ADC3.9 | IC16.2 142.24,81.92 142.56,81.92 143.19,82.55 143.83,82.55 144.15,82.87 R61.2 | C44.2 144.15,80.33 142.56,78.74 141.92,78.74 C43.2 141.6,78.74 145.1,82.23 144.46,82.87 R61.2 | 155.26,94.3 155.57,94.3 156.53,95.25 R65.2 | 155.26,94.3 153.67,94.3 IC17.2 153.35,93.98 152.72,93.98 152.08,93.34 153.03,92.39 153.03,90.81 C46.2 153.03,90.49 151.13,88.58 | 155.26,94.3 156.53,93.03 C47.2 | 151.13,88.58 148.91,86.36 146.37,86.36 145.41,85.41 145.41,84.14 144.46,83.19 R61.2 | 63.82,34.61 C8.2 64.58,34.61 v65.53,35.56 67.06,35.56 67.82,34.8 IC1.2 67.63,33.97 67.63,33.66 64.77,30.8 64.77,26.99 61.59,23.81 R39.2 61.59,23.5 62.23,22.86 62.23,19.05 R31.1 | ADC1.9 108.58,82.87 109.22,82.23 109.86,82.23 109.86,77.47 109.54,77.15 108.9,77.15 108.58,76.83 ADC1.14 108.27,76.52 107.95,76.2 v105.73,76.2 103.19,76.2 C3.2 102.87,75.88 101.28,74.3 104.46,71.12 104.46,55.88 104.14,55.56 102.87,55.56 | C34.2 163.83,70.17 v162.24,68.58 160.66,66.99 IC12.4 | v126.68,69.85 127.95,71.12 R22.2 | v126.68,69.85 126.36,69.53 125.41,69.53 IC15.2 125.09,69.53 124.14,68.58 124.14,68.26 124.78,67.63 124.78,65.41 C40.2 | v126.68,69.85 127.95,68.58 C41.2 | 117.47,32.07 118.75,33.34 R14.2 | 117.47,32.07 117.16,31.75 v116.84,31.75 115.89,31.75 IC13.2 115.57,31.43 115.25,31.11 114.62,31.11 113.98,30.48 115.25,29.21 115.25,28.26 C10.2
  Top 0.152: 117.47,32.07 118.75,30.8 C36.2 | ADC3.14 75.56,81.92 75.88,82.23 76.83,82.23 77.47,82.87 80.64,82.87 C2.2 80.96,83.19 81.92,84.14 81.92,87.31 88.9,94.3 RPI_DEBUG.1 | R26.1 47.62,29.84 47.62,31.43 54.29,38.1 +10V_LED.K | R28.2 48.58,77.15 40.96,77.15 39.69,75.88 C5.- | v135.89,24.45 135.89,23.18 C30.2 | 86.04,80.64 C1.2 84.14,78.74 v84.07,78.74 | v139.38,41.91 C12.2 | v142.24,61.91 142.24,60.64 C32.2 | v129.54,95.57 RPD1.2 | v141.92,19.68 141.92,18.73 IC5.4 | v142.88,38.73 142.88,37.78 IC10.4 | v145.73,57.15 145.73,56.52 IC11.4 | 88.27,74.93 ADC2.14 87.3,74.53 87.3,74.04 87.15,73.89 85.07,73.89 84.92,74.04 84.92,74.09 v82.8,76.2 | v95.25,75.25 94.61,75.25 ADC2.9 | 151.13,88.58 161.61,78.11 RZ4.A | 96.2,57.15 94.61,58.74 95.25,59.37 95.25,59.69 95.89,60.33 102.23,60.33 103.19,59.37 103.19,58.74 102.23,57.78
  Top 1.016: R10.2 12.95,103.57 v12.95,101.35 U$5.S | U$2.2 v26.67,108.52 R2.2 | R4.2 v38.12,108.67 U$3.2 | U$8.2 v51.04,109.14 R6.2 | R8.2 v62.52,109.39 U$9.2 | C4.- 34.48,80.2 3.3V_REG.1 39.2,75.52 C5.- | C6.- 29.57,57.91 5V_REG.1 32.49,60.83 32.49,61.65 32.89,62.05 33.71,62.05 37.08,65.43 C7.- | C16.- 10V_REG.2 C17.-
  pour Bottom: 0,119.38 170.18,119.38 170.18,0 0,0
IGNITION_RELAY  (via drill 0.38)
  Top 0.152: R1.1 39.37,114.3 39.69,114.62 v50.8,114.62 | v64.45,101.28 75.88,101.28 78.74,104.14 95.57,104.14 96.84,105.41 RPI_GPIO.16
  Bottom 0.152: v50.8,114.62 51.12,114.62 v64.45,101.28
LC1_PREC
  Top 0.152: 137.48,17.46 137.16,17.14 IC5.6 137.48,17.46 | 137.48,17.46 140.02,20 140.02,22.86 RF1.1 | LCIN1.2 132.08,10.16 133.99,10.16 139.38,15.56 137.48,17.46
LC2_PREC
  Top 0.152: 139.06,29.53 139.06,31.75 140.34,33.02 140.34,34.29 138.43,36.2 | 138.43,36.2 138.11,36.51 137.79,36.2 IC10.6 | 138.43,36.2 142.56,40.32 RF2.1 | 138.43,36.2 IC10.6 | LCIN2.2 132.4,29.21 132.4,31.75 136.53,35.88 137.16,35.88 137.48,36.2 IC10.6
LC3_PREC
  Top 0.152: 142.24,47.62 143.83,46.04 144.46,46.67 144.78,46.67 145.1,46.99 145.1,47.62 151.13,53.66 151.13,58.74 147.32,62.55 145.41,60.64 RF3.1 145.1,60.33 142.24,57.47 142.24,55.88 141.6,55.24 140.97,55.24 IC11.6 140.65,54.93 140.02,54.29 139.06,54.29 136.21,51.44 136.21,48.9 LCIN3.2
LC4_PREC
  Top 0.152: 152.08,68.9 152.72,68.9 154.94,71.12 154.94,72.39 158.12,75.56 | 158.12,75.56 158.75,76.2 159.07,76.2 160.34,74.93 | 160.34,74.93 160.97,74.3 159.7,73.03 159.7,72.39 159.38,72.07 IC12.6 | 160.34,74.93 160.66,74.93 162.88,77.15 167,73.03 167,71.44 166.37,70.8 166.37,69.53 165.1,68.26 165.1,67.31 RF4.1 | 158.12,75.56 158.12,79.06 157.16,80.01 156.53,80.01 153.67,77.15 149.86,77.15 LCIN4.2
LC_1_OUT+  (via drill 0.38)
  Top 0.152: v145.1,19.05 143.51,17.46 142.24,17.46 IC5.3 | LC1/2.A3 162.88,17.46 154.94,17.46 LC1/2.B3
  Bottom 0.152: v145.1,19.05 153.35,19.05 154.94,17.46 LC1/2.B3
LC_1_OUT-  (via drill 0.38)
  Top 0.152: v144.78,17.78 143.19,16.19 142.24,16.19 IC5.2 | LC1/2.A4 162.88,12.06 154.94,12.06 LC1/2.B4
  Bottom 0.152: v144.78,17.78 148.27,17.78 153.35,12.7 154.62,12.7 154.94,12.38 LC1/2.B4
LC_2_OUT+  (via drill 0.38)
  Top 0.152: v146.05,36.51 142.88,36.51 IC10.3 | LC1/2.A1 162.88,27.3 154.94,27.3 LC1/2.B1
  Bottom 0.152: v146.05,36.51 154.94,27.62 LC1/2.B1
LC_2_OUT-  (via drill 0.38)
  Top 0.152: v144.78,35.24 142.88,35.24 IC10.2 | LC1/2.A2 162.88,22.54 154.94,22.54 LC1/2.B2
  Bottom 0.152: v144.78,35.24 144.78,32.7 154.94,22.54 LC1/2.B2
LC_3_OUT+  (via drill 0.38)
  Top 0.152: v147.64,54.93 146.05,54.93 IC11.3 | LC3/4.A3 163.19,41.59 155.26,41.59 LC3/4.B3
  Bottom 0.152: v147.64,54.93 144.78,52.07 154.94,41.91 LC3/4.B3
LC_3_OUT-  (via drill 0.38)
  Top 0.152: v143.19,49.21 143.51,49.53 143.51,50.8 144.46,51.75 144.46,53.02 145.1,53.66 145.73,53.66 IC11.2 | LC3/4.A4 163.19,36.51 155.26,36.51 LC3/4.B4
  Bottom 0.152: v143.19,49.21 143.19,48.58 154.94,36.83 LC3/4.B4
LC_4_OUT+
  Top 0.152: IC12.3 159.07,66.99 159.07,68.26 156.15,70.42 154.56,68.83 155.57,64.45 155.26,64.14 155.26,52.07 LC3/4.B1
  Bottom 0.152: LC3/4.A1 163.19,52.07 155.26,52.07 LC3/4.B1
LC_4_OUT-  (via drill 0.38)
  Top 0.152: v158.12,64.14 158.12,66.67 IC12.2 | 158.12,52.07 158.12,49.85 155.26,46.99 LC3/4.B2 | 158.12,52.07 v158.12,61.28 | 158.12,52.07 163.19,46.99 LC3/4.A2
  Bottom 0.152: v158.12,61.28 v158.12,64.14
MISO  (via drill 0.38)
  Top 0.152: 88.9,81.6 89.22,81.6 101.92,94.3 RPI_DEBUG.6 101.92,94.61 104.46,97.16 104.46,102.87 RPI_GPIO.21 | 88.9,81.6 85.09,81.6 82.55,79.06 75.56,79.06 ADC3.12 | v90.49,77.79 90.49,75.25 ADC2.12 | 88.9,81.6 v88.9,79.69 | v95.57,73.03 101.6,79.06 108.27,79.06 ADC1.12
  Bottom 0.152: v88.9,79.69 90.49,78.11 | 90.49,78.11 v95.57,73.03 | 90.49,78.11 v90.49,77.79
MOSI  (via drill 0.38)
  Top 0.152: 95.57,93.03 95.57,95.89 101.92,102.23 101.92,102.87 RPI_GPIO.19 | 95.57,93.03 96.84,91.76 99.38,94.3 RPI_DEBUG.5 | 91.76,73.98 91.76,74.93 ADC2.11 | 91.76,73.98 93.66,72.07 101.28,79.69 107.63,79.69 108.27,80.33 ADC1.11 | v77.47,77.79 75.56,77.79 ADC3.11 | v80.01,75.25 84.45,70.8 85.09,71.44 89.22,71.44 91.76,73.98 | 95.57,93.03 94.93,92.39 93.34,92.39 v80.96,80.01
  Bottom 0.152: v80.01,75.25 78.11,77.15 | 78.11,77.15 v77.47,77.79 | 78.11,77.15 v80.96,80.01
N$1
  Top 0.152: R26.2 49.21,29.53 51.75,26.99 53.34,28.57 +12V_LED.K
N$2
  Top 0.152: R27.1 50.16,47.31 52.7,44.77 54.29,46.35 +5V_LED.K
N$3
  Top 0.152: R28.1 50.8,77.15 53.66,74.3 55.24,75.88 +3.3V_LED.K
N$4
  Top 2.032: U6.1 40.89,25.15 D5.A
N$5
  Top 0.152: 27.3,110.49 24.13,110.49 R2.1 | 27.3,110.49 28.26,110.49 U$2.1 | 27.3,110.49 27.3,114.3 R1.2
N$6
  Top 0.152: R3.2 40.32,113.35 40.32,110.49 U$3.1 40.01,110.49 36.83,110.49 R4.1
N$7
  Top 0.152: R5.2 53.34,113.98 53.34,111.44 U$8.1 53.02,111.12 49.53,111.12 R6.1
N$8
  Top 0.152: 64.14,111.76 64.14,113.98 R7.2 | 64.14,111.76 64.14,111.12 U$9.1 | 64.14,111.76 60.96,111.76 R8.1
N$9
  Top 0.152: R35.1 53.02,38.1 53.98,39.05 55.88,39.05 56.83,38.1 +10V_LED.A
N$10
  Top 0.152: IC1.3 68.58,33.97 68.58,33.02 65.72,30.16 R37.2 66.04,29.84 66.04,25.72 R36.1
N$11
  Top 0.152: R41.1 66.67,40.96 66.67,44.77 C19.1 66.36,45.09 67.31,46.04 64.77,48.58 R40.2
N$12
  Top 0.152: IC1.1 66.67,33.97 61.59,28.89 R38.2 61.59,28.57 61.59,25.72 R39.1
N$13
  Top 0.152: 121.6,35.56 124.78,38.73 119.06,44.45 118.43,44.45 117.47,43.5 117.47,41.27 113.98,37.78 113.98,35.24 C11.1 | 121.6,35.56 121.6,33.02 R12.2 | 121.6,35.56 R11.1
N$14
  Top 0.152: R9.2 16.19,109.22 16.19,105.09 R10.1 16.19,104.78 20.32,100.65 18.1,98.42 U$5.G
N$15
  Top 0.152: SOLENOIDS2.B2 7.94,82.23 15.88,82.23 SOLENOIDS2.A2
N$16
  Top 0.152: IC13.1 115.89,30.48 118.11,28.26 118.75,28.89 C36.1 119.06,28.89 120.97,30.8 121.6,30.8 R12.1
N$17
  Top 0.152: 117.79,55.88 120.02,58.1 120.02,59.37 115.25,64.14 114.3,64.14 113.35,63.18 113.35,60.96 112.71,60.33 112.39,60.33 110.49,58.42 110.49,55.88 C39.1 | 117.79,55.88 117.79,53.34 R16.2 | 117.79,55.88 R15.1
N$18
  Top 0.152: IC13.4 113.03,32.7 113.35,32.7 115.57,34.92 C11.2 115.89,35.24 116.84,36.2 116.84,37.78 R13.1
N$19
  Top 0.152: IC14.1 112.08,51.12 113.35,51.12 114.62,49.85 C38.1 114.94,49.85 116.2,51.12 117.47,51.12 R16.1
N$20
  Top 0.152: IC14.4 109.54,53.34 112.08,55.88 C39.2 112.39,55.88 112.71,56.2 112.71,58.74 R17.1
N$21
  Top 0.152: 140.97,30.48 140.97,32.07 141.29,32.38 | 140.97,30.48 140.97,29.53 | 141.29,32.38 142.56,33.66 IC10.1 | 140.97,30.48 145.1,34.61 147.32,34.61 RG2.2 | 141.29,32.38 141.29,38.1 144.15,40.96 144.15,41.91 RF2.2
N$22  (via drill 0.38)
  Top 0.152: RG2.1 147.32,36.51 147.32,40.96 143.51,44.77 141.6,42.86 141.6,41.59 137.79,37.78 IC10.5 137.48,37.47 137.16,37.15 136.53,37.15 135.89,36.51 v134.3,36.51
  Bottom 0.152: v134.3,36.51 131.76,37.78 131.13,37.78 RZ2.S
N$23
  Top 0.152: IC14.3 112.08,53.34 112.39,53.34 114.62,55.56 R18.1 114.94,55.88 114.94,58.74 R17.2 114.94,59.05 114.94,62.23 LC2.2
N$24
  Top 0.152: C42.1 123.51,73.66 123.51,76.2 127,79.69 127,81.92 127.64,82.55 128.91,82.55 134.62,76.83 131.76,73.98 R19.1 131.76,73.66 131.13,73.03 131.13,70.8 R20.2
N$25
  Top 0.152: IC6.1 68.26,56.52 68.26,53.34 66.99,52.07 C20.1 66.67,52.07 66.67,48.9 R40.1
N$26
  Top 0.152: IC2.3 78.42,33.97 78.42,33.02 78.11,32.7 78.11,31.11 76.83,29.84 R43.2 76.83,29.53 76.83,25.72 R42.1
N$27
  Top 0.152: IC2.1 76.52,33.97 76.2,33.97 71.12,28.89 R44.2 R45.1
N$28
  Top 0.152: R46.1 75.25,40.96 75.25,44.77 C22.1 75.25,45.09 74.3,46.04 74.3,48.26 R47.2
N$29
  Top 0.152: IC7.1 76.83,56.52 76.83,53.98 75.25,52.39 C23.1 75.56,52.07 75.56,48.58 R47.1
N$30
  Top 0.152: 88.27,45.72 88.27,41.91 R48.1 | 88.27,45.72 87,46.99 87,49.21 R49.2 | 88.27,45.72 C25.1
N$31
  Top 0.152: IC8.1 89.22,56.2 89.22,52.07 C26.1 88.9,52.07 88.58,51.75 88.58,49.53 R49.1
N$32
  Top 0.152: R50.1 98.42,41.59 98.42,45.09 C28.1 98.42,45.4 99.38,46.35 96.84,48.9 R51.2
N$33
  Top 0.152: IC9.1 101.92,56.52 101.92,55.24 99.06,52.39 C29.1 98.74,52.07 98.74,49.21 R51.1
N$34
  Top 0.152: IC3.3 90.17,34.92 90.17,31.43 88.9,30.16 R52.2 88.9,29.84 88.9,25.4 R34.1
N$35
  Top 0.152: IC3.1 88.27,34.92 88.27,33.97 82.87,28.57 R53.2 82.87,28.26 82.87,25.08 R54.1
N$36
  Top 0.152: 100.01,30.8 99.69,30.48 R57.2 100.01,30.8 | 100.01,30.8 100.65,31.43 100.65,34.92 IC4.3 | 100.01,30.8 100.01,25.72 R56.1
N$37
  Top 0.152: R58.2 98.74,33.02 98.74,34.92 IC4.1 | R58.2 R59.1 | R58.2
N$38
  Top 0.152: IC15.1 125.41,68.26 127.64,66.04 127.95,66.36 C41.1 128.27,66.67 130.49,68.9 130.81,68.9 R20.1
N$39
  Top 0.152: 144.15,47.94 144.15,50.8 145.73,52.39 IC11.1 146.05,52.7 147.96,52.7 149.54,54.29 | 149.54,54.29 147.32,56.52 147.32,60.33 RF3.2 | 149.54,54.29 149.86,54.61 RG3.2 149.54,54.29
N$40
  Top 0.152: IC15.4 122.87,70.48 122.87,71.12 125.09,73.34 C42.2 125.41,73.66 126.05,74.3 126.05,75.88 R21.1
N$41
  Top 0.152: RF1.2 142.24,22.86 142.88,23.5 146.05,20.32 RG1.2 146.05,20 146.05,18.1 140.65,12.7 | 140.65,12.7 140.65,13.34 141.92,14.61 IC5.1 | 140.65,12.7 140.65,10.16
N$42  (via drill 0.51)
  Top 0.152: v134.62,18.54 136.72,18.54 IC5.5 138.68,20.51 138.68,24.38 143.95,24.38 RG1.1
  Bottom 0.152: RZ1.S 131.83,18.54 v134.62,18.54
N$43  (via drill 0.38)
  Top 0.152: v148.27,56.52 149.86,56.52 RG3.1 | v137.48,53.98 139.7,56.2 140.65,56.2 IC11.5
  Bottom 0.152: v148.27,56.52 141.6,49.85 v137.48,53.98 134.3,57.15 133.35,57.15 RZ3.S
N$44
  Top 0.152: IC15.3 125.41,70.48 127.95,73.03 R22.1 127.95,73.34 127.95,75.88 R21.2 127.95,76.2 128.27,76.52 LC3.2
N$45  (via drill 0.38)
  Top 0.152: v141.29,86.68 140.34,85.72 140.34,85.09 C45.1 | R24.2 147,82.87 146.69,82.55 v145.73,83.5 147,84.77 147,85.09 R23.1
  Bottom 0.152: v141.29,86.68 142.56,86.68 v145.73,83.5
N$46  (via drill 0.38)
  Top 0.152: 152.08,70.8 153.67,70.8 v153.99,71.12 | v155.51,68.07 156.53,66.99 IC12.1 156.53,66.67 156.53,65.41 156.21,65.09 158.12,63.18 157.8,62.87 RG4.2 157.8,62.55 160.02,60.33 164.78,65.09 RF4.2
  Bottom 0.152: v155.51,68.07 v153.99,71.12
N$47  (via drill 0.38)
  Top 0.152: 162.88,74.3 160.66,72.07 IC12.5 | 162.88,74.3 163.83,75.25 166.37,72.71 166.37,71.44 166.05,71.12 163.83,71.12 160.97,68.26 160.02,68.26 159.7,67.94 159.7,62.87 RG4.1 | 162.88,74.3 v161.93,75.25
  Bottom 0.152: v161.93,75.25 159.38,77.79 159.38,78.11 RZ4.S
N$48  (via drill 0.38)
  Top 0.152: v143.19,81.6 142.56,80.96 142.24,80.96 IC16.1 | 146.37,80.64 146.69,80.33 147,80.64 R24.1 146.37,80.64 | 146.37,80.64 v145.41,81.6 | 146.37,80.64 144.46,78.74 C44.1
  Bottom 0.152: v145.41,81.6 v143.19,81.6
N$49
  Top 0.152: C45.2 139.7,82.87 IC16.4 | C45.2 142.56,85.72 142.56,87.63 R60.1 | C45.2
N$50
  Top 0.152: IC13.3 115.89,32.7 116.2,32.7 118.75,35.24 R14.1 119.06,35.24 119.06,37.78 R13.2 119.06,38.1 119.06,42.23 LC1.2
N$51
  Top 0.152: IC16.3 142.24,82.87 144.15,84.77 R61.1 144.46,85.09 144.46,87.63 R60.2 144.46,87.95 145.41,88.9 145.41,93.66 LC4.2
N$52
  Top 0.152: LCIN1.1 123.51,11.11 123.51,35.56 R11.2
N$53  (via drill 0.38)
  Top 0.152: v119.7,52.39 119.7,55.88 R15.2 | v120.97,51.12 120.97,43.18 128.59,35.56 128.59,30.16 129.54,29.21 LCIN2.1
  Bottom 0.152: v120.97,51.12 v119.7,52.39
N$54  (via drill 0.38)
  Top 0.152: v133.67,70.48 133.67,73.66 R19.2 | v134.62,69.53 134.62,63.18 131.76,60.33 131.76,50.8 133.67,48.9 LCIN3.1
  Bottom 0.152: v134.62,69.53 v133.67,70.48
N$55
  Top 0.152: R23.2 149.22,85.09 152.4,81.92 149.86,79.38 LCIN4.1
N$56
  Top 0.152: C48.1 151.45,97.47 151.45,98.74 154.31,101.6 154.62,101.6 155.26,102.23 155.26,104.46 156.21,105.41 157.16,105.41 161.93,100.65 159.38,98.11 R62.1 159.7,97.79 159.7,95.25 R63.2
N$57
  Top 0.152: IC17.1 153.67,93.03 156.21,90.49 156.53,90.81 C47.1 156.84,91.12 158.75,93.03 159.38,93.03 R63.1
N$58
  Top 0.152: IC17.4 151.13,95.25 153.03,97.16 C48.2 153.35,97.47 154.31,98.42 154.31,99.69 R64.1
N$59
  Top 0.152: IC17.3 153.67,95.25 154.62,95.25 156.53,97.16 R65.1 156.53,97.47 156.53,99.69 R64.2 156.53,100.01 156.53,103.5 LC5.2
N$60
  Top 0.152: R62.2 161.61,98.11 164.15,98.11 LCIN5.1
PT1_PREC
  Top 0.152: R41.2 68.58,40.64 68.58,37.15 IC1.4 68.9,36.83 69.53,36.2 69.53,33.34 67.94,31.75 67.94,30.16 R37.1
PT1_VS-
  Top 0.152: R36.2 66.04,23.5 64.45,21.91 64.45,19.05 R31.2 64.14,19.05 64.14,15.56 62.23,13.65 PT1/2.A2
  Bottom 0.152: PT1/2.B2 62.23,5.4 62.23,13.34 PT1/2.A2
PT2_PREC
  Top 0.152: R46.2 77.15,40.64 78.42,39.37 78.42,36.83 IC2.4 78.74,36.51 79.38,35.88 79.38,33.34 78.74,32.7 78.74,29.84 R43.1
PT2_VS-
  Top 0.152: R42.2 76.52,23.5 73.66,20.64 73.66,19.05 R32.2 73.34,19.05 73.34,14.61 72.39,13.65 PT1/2.A4
  Bottom 0.152: PT1/2.B4 72.39,5.4 72.39,13.34 PT1/2.A4
PT3_PREC
  Top 0.152: R48.2 90.17,41.91 90.17,37.78 IC3.4 90.49,37.47 91.12,36.83 91.12,34.29 90.81,33.97 90.81,30.16 R52.1
PT3_VS-
  Top 0.152: R34.2 88.9,23.18 87.63,21.91 87.63,20 R33.2 87.31,19.68 87.31,15.88 85.09,13.65 PT3/4.A2
  Bottom 0.152: PT3/4.B2 84.77,5.4 84.77,13.34 PT3/4.A2
PT4_PREC
  Top 0.152: R50.2 100.33,41.27 98.74,39.69 100.65,37.78 IC4.4 100.97,37.47 101.6,36.83 101.6,34.61 101.28,34.29 101.28,30.48 R57.1
PT4_VS-
  Top 0.152: R56.2 100.01,23.5 97.16,20.64 97.16,19.68 R55.2 96.84,19.37 96.84,14.92 95.57,13.65 PT3/4.A4 95.25,13.34 95.25,5.4 PT3/4.B4
RELAY_NEGATIVE
  Top 1.016: SOL+RELAY.B1 SOL+RELAY.A1 16.07,79.37 18.41,81.71 18.41,88.77 30.99,101.35 D1.A 30.56,105.33 U$2.3
SCLK  (via drill 0.38)
  Top 0.152: v89.22,77.47 89.22,75.25 ADC2.13 | v88.27,78.42 88.58,78.42 104.46,94.3 RPI_DEBUG.7 104.46,94.61 107,97.16 107,102.87 RPI_GPIO.23 | v95.25,71.44 101.6,77.79 108.27,77.79 ADC1.13 | v80.33,81.6 79.38,80.64 75.56,80.64 ADC3.13
  Bottom 0.152: v95.25,71.44 v89.22,77.47 v88.27,78.42 85.09,81.6 v80.33,81.6
SOLENOID_1_NEGATIVE
  Top 1.016: SOL+RELAY.B2 SOL+RELAY.A2 16.26,68.95 | U$3.3 42.42,107.95 D2.A 30.99,96.27 29.09,96.27 19.6,86.78 19.6,74.7 16.26,71.35 16.26,68.95 | 16.26,68.58 16.26,68.95
SOLENOID_2_NEGATIVE
  Top 1.016: SOLENOIDS.B1 SOLENOIDS.A1 16.07,66.17 20.8,70.89 20.8,85.31 24.89,89.41 36.83,89.41 D3.A 53.09,106.95 54.64,108.5 54.64,109.42 U$8.3
SOLENOID_3_NEGATIVE
  Top 1.016: SOLENOIDS.B2 SOLENOIDS.A2 16.07,58.21 21.99,64.13 21.99,84.47 25.65,88.14 49.53,88.14 D4.A U$9.3
SOLENOID_4_NEGATIVE
  Top 1.016: SOLENOIDS2.B1 SOLENOIDS2.A1 16.76,88.03 D6.A 16.76,96.76 16.59,96.94 16.59,97.21 U$5.D

## Text on the board
tPlace: Rice Eclipse | C Shannon Rev 1.1 | eclipse.rice.edu